# EAGLE design Arduino Maple Uno (EAGLE 9.2.2)
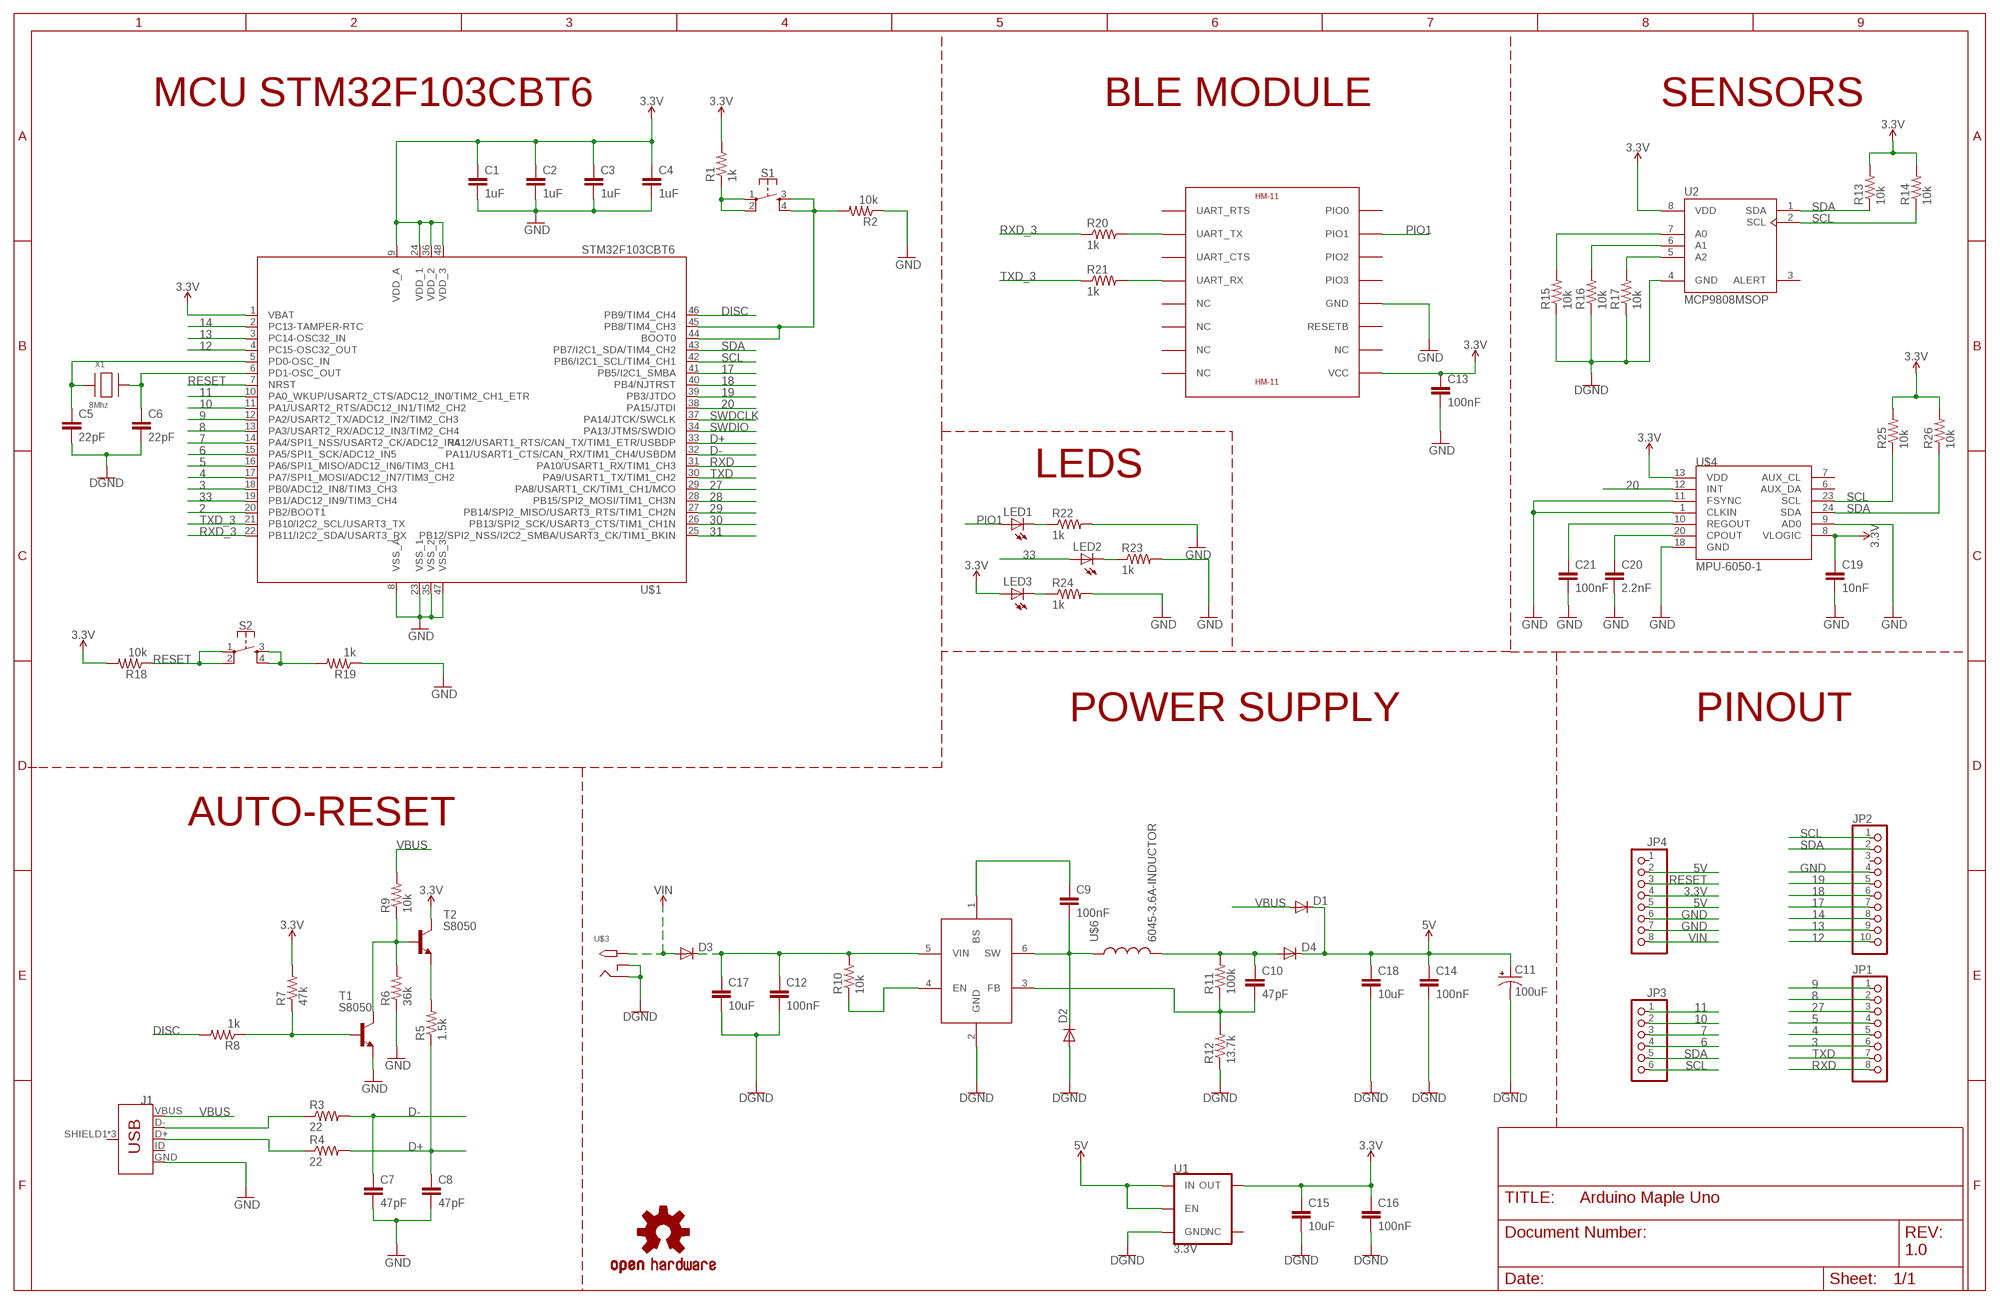
[diagram p0: schematic, sheet 1]

## Parts
C1  1uF  C-EUC0603  [C0603]
C2  1uF  C-EUC0603  [C0603]
C3  1uF  C-EUC0603  [C0603]
C4  1uF  C-EUC0603  [C0603]
C5  22pF  C-EUC0603  [C0603]
C6  22pF  C-EUC0603  [C0603]
C7  47pF  C-EUC0603  [C0603]
C8  47pF  C-EUC0603  [C0603]
C9  100nF  C-EUC0603  [C0603]
C10  47pF  C-EUC0603  [C0603]
C11  100uF  CPOL-USCT3528  [CT3528]
C12  100nF  C-EUC0603  [C0603]
C13  100nF  C-EUC0603  [C0603]
C14  100nF  C-EUC0603  [C0603]
C15  10uF  C-EUC0805  [C0805]
C16  100nF  C-EUC0603  [C0603]
C17  10uF  C-EUC1206  [C1206]
C18  10uF  C-EUC0805  [C0805]
C19  10nF  C-EUC0603  [C0603]
C20  2.2nF  C-EUC0603  [C0603]
C21  100nF  C-EUC0603  [C0603]
D1  DIODE-DO-214AC  [DO-214AC]
D2  DIODE-DO-214AC  [DO-214AC]
D3  DIODE-DO-214AC  [DO-214AC]
D4  DIODE-DO-214AC  [DO-214AC]
J1  USB_MICRO-B_FEMALE-SMT  [USB-B-MICRO-SMD]
JP1  PINHD-1X8  [1X08]
JP2  PINHD-1X10  [1X10]
JP3  PINHD-1X6  [1X06]
JP4  PINHD-1X8  [1X08]
LED1  LEDCHIPLED_0603  [CHIPLED_0603]
LED2  LEDCHIPLED_0603  [CHIPLED_0603]
LED3  LEDCHIPLED_0603  [CHIPLED_0603]
LOGO1  OSHW-LOGOL-COPPER  [OSHW-LOGO-L_COPPER]
R1  1k  R-US_R0603  [R0603]
R2  10k  R-US_R0603  [R0603]
R3  22  R-US_R0603  [R0603]
R4  22  R-US_R0603  [R0603]
R5  1.5k  R-US_R0603  [R0603]
R6  36k  R-US_R0603  [R0603]
R7  47k  R-US_R0603  [R0603]
R8  1k  R-US_R0603  [R0603]
R9  10k  R-US_R0603  [R0603]
R10  10k  R-US_R0603  [R0603]
R11  100k  R-US_R0603  [R0603]
R12  13.7k  R-US_R0603  [R0603]
R13  10k  R-US_R0603  [R0603]
R14  10k  R-US_R0603  [R0603]
R15  10k  R-US_R0603  [R0603]
R16  10k  R-US_R0603  [R0603]
R17  10k  R-US_R0603  [R0603]
R18  10k  R-US_R0603  [R0603]
R19  1k  R-US_R0603  [R0603]
R20  1k  R-US_R0603  [R0603]
R21  1k  R-US_R0603  [R0603]
R22  1k  R-US_R0603  [R0603]
R23  1k  R-US_R0603  [R0603]
R24  1k  R-US_R0603  [R0603]
R25  10k  R-US_R0603  [R0603]
R26  10k  R-US_R0603  [R0603]
S1  MOMENTARY-SWITCH-SPST-2-SMD-5.2MM  [TACTILE_SWITCH_SMD_5.2MM]
S2  MOMENTARY-SWITCH-SPST-2-SMD-5.2MM  [TACTILE_SWITCH_SMD_5.2MM]
T1  S8050  BC847  [SOT23]
T2  S8050  BC847  [SOT23]
U1  3.3V  V_REG_AP2112K-3.3V  [SOT23-5]
U2  MCP9808MSOP  [MSOP-8]
U$1  STM32F103CBT6  [STM32_LQFP48]
U$2  SY8113  [TSOT23-6]
U$3  2.1MMJACKTHM  [PJ-102A]
U$4  MPU-6050-1  [TESTING_QFN-24-4MM2]
U$5  HM-11  [HM-11]
U$6  6045-3.6A-INDUCTOR  [INDC6161X450]
X1  8Mhz  XTALNX5032  [NX5032]

## Nets
2: U$1.20(PB2/BOOT1)
3: JP1.6 U$1.18(PB0/ADC12_IN8/TIM3_CH3)
3.3V: C1.1 C2.1 C3.1 C4.1 C13.1 C15.1 C16.1 C19.1 JP4.4 LED3.A R1.2 R7.2 R13.2 R14.2 R18.2 R25.2 R26.2 T2.3(C) U1.5(OUT) U2.8(VDD) U$1.1(VBAT) U$1.9(VDD_A) U$1.24(VDD_1) U$1.36(VDD_2) U$1.48(VDD_3) U$4.8(VLOGIC) U$4.13(VDD) U$5.VCC
4: JP1.5 U$1.17(PA7/SPI1_MOSI/ADC12_IN7/TIM3_CH2)
5: JP1.4 U$1.16(PA6/SPI1_MISO/ADC12_IN6/TIM3_CH1)
5V: C11.+ C14.1 C18.1 D1.C D4.C JP4.2 JP4.5 U1.1(IN) U1.3(EN)
6: JP3.4 U$1.15(PA5/SPI1_SCK/ADC12_IN5)
7: JP3.3 U$1.14(PA4/SPI1_NSS/USART2_CK/ADC12_IN4)
8: JP1.2 U$1.13(PA3/USART2_RX/ADC12_IN3/TIM2_CH4)
9: JP1.1 U$1.12(PA2/USART2_TX/ADC12_IN2/TIM2_CH3)
10: JP3.2 U$1.11(PA1/USART2_RTS/ADC12_IN1/TIM2_CH2)
11: JP3.1 U$1.10(PA0_WKUP/USART2_CTS/ADC12_IN0/TIM2_CH1_ETR)
12: JP2.10 U$1.4(PC15-OSC32_OUT)
13: JP2.9 U$1.3(PC14-OSC32_IN)
14: JP2.8 U$1.2(PC13-TAMPER-RTC)
17: JP2.7 U$1.41(PB5/I2C1_SMBA)
18: JP2.6 U$1.40(PB4/NJTRST)
19: JP2.5 U$1.39(PB3/JTDO)
20: U$1.38(PA15/JTDI) U$4.12(INT)
27: JP1.3 U$1.29(PA8/USART1_CK/TIM1_CH1/MCO)
28: U$1.28(PB15/SPI2_MOSI/TIM1_CH3N)
29: U$1.27(PB14/SPI2_MISO/USART3_RTS/TIM1_CH2N)
30: U$1.26(PB13/SPI2_SCK/USART3_CTS/TIM1_CH1N)
31: U$1.25(PB12/SPI2_NSS/I2C2_SMBA/USART3_CK/TIM1_BKIN)
33: LED2.A U$1.19(PB1/ADC12_IN9/TIM3_CH4)
D+: C8.1 R4.2 R5.1 U$1.33(PA12/USART1_RTS/CAN_TX/TIM1_ETR/USBDP)
D-: C7.1 R3.2 U$1.32(PA11/USART1_CTS/CAN_RX/TIM1_CH4/USBDM)
DISC: R8.2 U$1.46(PB9/TIM4_CH4)
GND: C1.2 C2.2 C3.2 C4.2 C5.2 C6.2 C7.2 C8.2 C11.- C12.2 C13.2 C14.2 C15.2 C16.2 C17.2 C18.2 C19.2 C20.2 C21.2 D2.A J1.GND JP2.4 JP4.6 JP4.7 R2.1 R6.1 R12.1 R15.1 R16.1 R17.1 R19.1 R22.2 R23.2 R24.2 T1.2(E) U1.2(GND) U2.4(GND) U$1.8(VSS_A) U$1.23(VSS_1) U$1.35(VSS_2) U$1.47(VSS_3) U$2.2(GND) U$3.RING U$3.RING_SW U$4.1(CLKIN) U$4.9(AD0) U$4.11(FSYNC) U$4.18(GND) U$5.GND ; supply symbol labelled DGND
N$1: R1.1 S1.1 S1.2
N$2: C5.1 U$1.5(PD0-OSC_IN) X1.P$1
N$3: C6.1 U$1.6(PD1-OSC_OUT) X1.P$2
N$4: R2.2 S1.3 S1.4 U$1.44(BOOT0) U$1.45(PB8/TIM4_CH3)
N$5: C9.2 D2.C U$2.6(SW) U$6.1
N$6: J1.D- R3.1
N$7: J1.D+ R4.1
N$8: R5.2 T2.2(E)
N$9: R6.2 R9.1 T1.3(C) T2.1(B)
N$10: R7.1 R8.1 T1.1(B)
N$11: R19.2 S2.3 S2.4
N$12: LED1.C R22.1
N$13: R15.2 U2.7(A0)
N$14: R10.1 U$2.4(EN)
N$15: C9.1 U$2.1(BS)
N$16: C10.2 R11.1 R12.2 U$2.3(FB)
N$17: R16.2 U2.6(A1)
N$18: R17.2 U2.5(A2)
N$19: R20.2 U$5.UART_TX
N$20: C12.1 C17.1 D3.C R10.2 U$2.5(VIN)
N$21: R21.2 U$5.UART_RX
N$22: LED2.C R23.1
N$23: LED3.C R24.1
N$24: C10.1 D4.A R11.2 U$6.2
N$33: C21.1 U$4.10(REGOUT)
N$35: C20.1 U$4.20(CPOUT)
PIO1: LED1.A U$5.PIO1
RESET: JP4.3 R18.1 S2.1 S2.2 U$1.7(NRST)
RXD: JP1.8 U$1.31(PA10/USART1_RX/TIM1_CH3)
RXD_3: R20.1 U$1.22(PB11/I2C2_SDA/USART3_RX)
SCL: JP2.1 JP3.6 R14.1 R25.1 U2.2(SCL) U$1.42(PB6/I2C1_SCL/TIM4_CH1) U$4.23(SCL)
SDA: JP2.2 JP3.5 R13.1 R26.1 U2.1(SDA) U$1.43(PB7/I2C1_SDA/TIM4_CH2) U$4.24(SDA)
SWDCLK: U$1.37(PA14/JTCK/SWCLK)
SWDIO: U$1.34(PA13/JTMS/SWDIO)
TXD: JP1.7 U$1.30(PA9/USART1_TX/TIM1_CH2)
TXD_3: R21.1 U$1.21(PB10/I2C2_SCL/USART3_TX)
VBUS: D1.A J1.VBUS R9.2
VIN: D3.A JP4.8 U$3.TIP
Unconnected: J1.ID J1.SHIELD1(SHIELD) J1.SHIELD2(SHIELD) J1.SHIELD3(SHIELD) JP2.3 JP4.1 U1.4(NC) U2.3(ALERT) U$4.6(AUX_DA) U$4.7(AUX_CL) U$5.NC@5(NC) U$5.NC@6(NC) U$5.NC@7(NC) U$5.NC@8(NC) U$5.NC@10(NC) U$5.PIO0 U$5.PIO2 U$5.PIO3 U$5.RESETB U$5.UART_CTS U$5.UART_RTS

## Notes on the sheet
- MCU STM32F103CBT6 | BLE MODULE | SENSORS
- LEDS
- POWER SUPPLY | PINOUT
- AUTO-RESET
- 1.0

## Library data of the parts
C1-C6 C15 C18 = rcl:C-EU: CAPACITOR, European symbol; SPICEPREFIX: C
C7-C10 C12-C14 C16 C17 C19-C21 = resistor:C-EU: CAPACITOR, European symbol
C11 = rcl:CPOL-US: POLARIZED CAPACITOR, American symbol; SPICEPREFIX: C
D1-D4 = diode:DIODE-: DIODE
J1 = SparkFun-Connectors:USB_MICRO-B: USB Type Micro-B Connector Male/female and PTH/SMT variants SparkFun Products: SparkFun microB USB Breakout <https://www.sparkfun.com/products/12035> SparkFun USB microB Plug Breakout <https://www.sparkfun.com/products/10031> SparkFun ESP8266 Thing <https://www.sparkfun.com/products/13231>; PROD_ID: CONN-11752
JP1 JP4 = pinhead:PINHD-1X8: PIN HEADER
JP2 = pinhead:PINHD-1X10: PIN HEADER
JP3 = pinhead:PINHD-1X6: PIN HEADER
LED1-LED3 = led:LED: LED OSRAM: - CHIPLED LG R971, LG N971, LY N971, LG Q971, LY Q971, LO R971, LY R971 LH N974, LH R974 LS Q976, LO Q976, LY Q976 LO Q996 - Hyper CHIPLED LW Q18S LB Q993, LB Q99A, LB R99A - SideLED LS A670, LO A670, LY A670, LG A670, LP A670 LB A673, LV A673, LT A673, LW A673 LH A674 LY A675 LS A676, LA A676, LO A676, LY A676, LW A676 LS A679, LY A679, LG A679 - Hyper Micro SIDELED® LS Y876, LA Y876, LO Y876, LY Y876 LT Y87S - SmartLED LW L88C, LW L88S LB L89C, LB L89S, LG L890 LS L89K, LO L89K, LY L89K LS L896, LA L896, LO L896, LY L896 - TOPLED LS T670, LO T670, LY T670, LG T670, LP T670 LSG T670, LSP T670, LSY T670, LOP T670, LYG T670 LG T671, LOG T671, LSG T671 LB T673, LV T673, LT T673, LW T673 LH T674 LS T676, LA T676, LO T676, LY T676, LB T676, LH T676, LSB T676, LW T676 LB T67C, LV T67C, LT T67C, LS T67K, LO T67K, LY T67K, LW E67C LS E67B, LA E67B, LO E67B, LY E67B, LB E67C, LV E67C, LT E67C LW T67C LS T679, LY T679, LG T679 LS T770, LO T770, LY T770, LG T770, LP T770 LB T773, LV T773, LT T773, LW T773 LH T774 LS E675, LA E675, LY E675, LS T675 LS T776, LA T776, LO T776, LY T776, LB T776 LHGB T686 LT T68C, LB T68C - Hyper Mini TOPLED® LB M676 - Mini TOPLED Santana® LG M470 LS M47K, LO M47K, LY M47K Source: http://www.osram.convergy.de LUXEON: - LUMILED® LXK2-PW12-R00, LXK2-PW12-S00, LXK2-PW14-U00, LXK2-PW14-V00 LXK2-PM12-R00, LXK2-PM12-S00, LXK2-PM14-U00 LXK2-PE12-Q00, LXK2-PE12-R00, LXK2-PE12-S00, LXK2-PE14-T00, LXK2-PE14-U00 LXK2-PB12-K00, LXK2-PB12-L00, LXK2-PB12-M00, LXK2-PB14-N00, LXK2-PB14-P00, LXK2-PB14-Q00 LXK2-PR12-L00, LXK2-PR12-M00, LXK2-PR14-Q00, LXK2-PR14-R00 LXK2-PD12-Q00, LXK2-PD12-R00, LXK2-PD12-S00 LXK2-PH12-R00, LXK2-PH12-S00 LXK2-PL12-P00, LXK2-PL12-Q00, LXK2-PL12-R00 Source: www.luxeon.com KINGBRIGHT: KA-3528ASYC Source: www.kingbright.com
LOGO1 = SparkFun-Aesthetics:OSHW-LOGO: Open-Source Hardware (OSHW) Logo This logo indicates the piece of hardware it is found on incorporates a OSHW license and/or adheres to the definition of open source hardware found here: http://freedomdefined.org/OSHW
R1 R2 R10-R12 R18-R24 = rcl:R-US_: RESISTOR, American symbol; SPICEPREFIX: R
R3-R9 R13-R17 R25 R26 = resistor:R-US_: RESISTOR, American symbol
S1 S2 = SPEAR:MOMENTARY-SWITCH-SPST-2: Momentary Switch (Pushbutton) - SPST - Two Circuits Normally-open (NO) SPST momentary switches (buttons, pushbuttons). Schematic symbol includes two switch circuits. Variants SMD-4.6MMX2.8MM - 4.60mm x 2.80mm Tactile Momentary Button Switch - Used on SparkFun SAMD21 Mini Breakout <https://www.sparkfun.com/products/13664> SMD-5.2MM - Mini Pushbutton Switch - SMD <https://www.sparkfun.com/products/8720> - Used on Arduino Pro Mini <https://www.sparkfun.com/products/11114>; PROD_ID: SWCH-08247; SF_SKU: COM-08720
T1 T2 = transistor:BC847: NPN TRANSISTOR
U1 = SparkFun-IC-Power:V_REG_AP2112: AP2112 - 600mA CMOS LDO Regulator w/ Enable The AP2112 is CMOS process low dropout linear regulator with enable function, the regulator delivers a guaranteed 600mA (min.) continuous load current. Features Output Voltage Accuracy: ±1.5% Output Current: 600mA (Min.) Foldback Short Current Protection: 50mA Enable Function to Turn ON/OFF VOUT Low Dropout Voltage (3.3V): 250mV (Typ.) @IOUT=600mA Excellent Load Regulation: 0.2%/A (Typ.) Excellent Line Regulation: 0.02%/V (Typ.) Low Quiescent Current: 55μA (Typ.) Low Standby Current: 0.01μA (Typ.) Low Output Noise: 50μVRMS PSRR: 100Hz -65dB, 1kHz -65dB OTSD Protection Stable with 1.0μF Flexible Cap: Ceramic, Tantalum and Aluminum Electrolytic Operation Temperature Range: -40°C to 85°C ESD: MM 400V, HBM 4000V; PROD_ID: VREG-12457
U2 = LCSC:MCP9808; AVAILABILITY: Unavailable; DESCRIPTION: MCP9808 Series SMD 3.6 V Memory Module Digital Temperature Sensor - MSOP-8; MF: Microchip; MP: MCP9808-E/MS; PACKAGE: MSOP-8 Microchip; PRICE: None
U$1 = SPEAR:STM32F103CBT6
U$2 = LCSC:SY8113
U$3 = adafruit:2.1MMJACK: 2.1mm x 5.5mm THM DC jack with internal switch. Digikey part #PJ-102A, 4UCON part #05537 2.1mm x 5.5mm SMT DC jack with internal switch. Digikey part #PJ-002A-SMT, 4UCON part #03267 By microbuilder.eu & adafruit.com
U$4 = LCSC:MPU-6050
U$5 = LCSC:HM-11: JNHuaMao HM-11 Bluetooth 4.0 Transceiver based on TI CC2540/CC2541
U$6 = LCSC:6045-3.6A-INDUCTOR
X1 = adafruit:XTAL: Low cost SMT crystals, no capacitors included http://www.ladyada.net/library/eagle

## Board
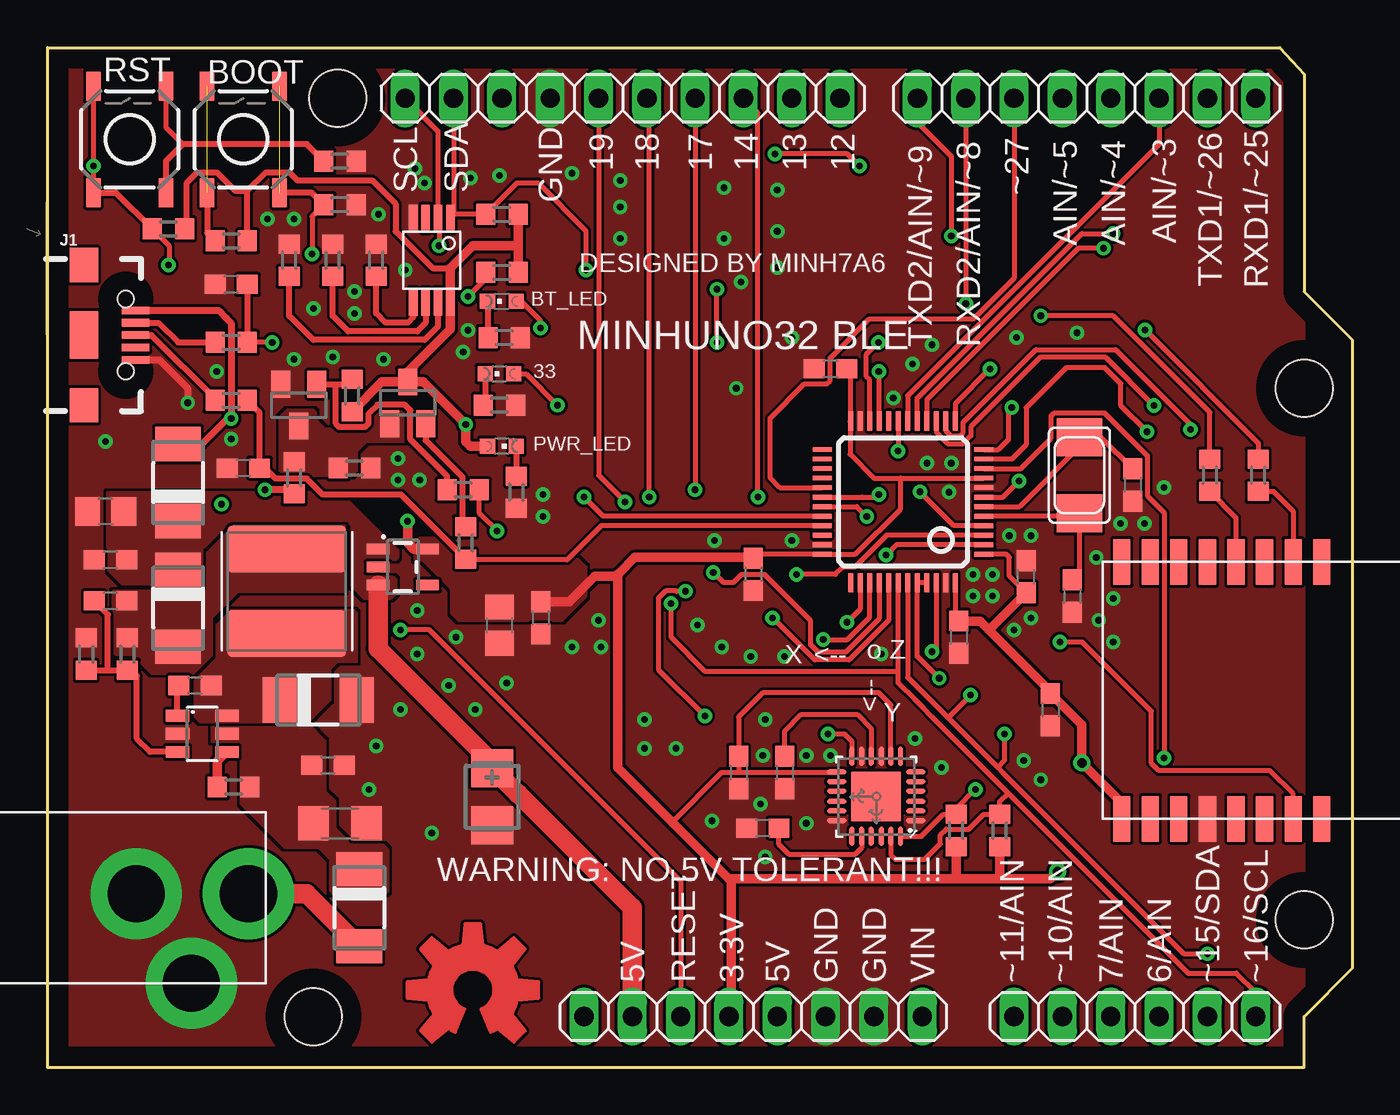
[diagram p1: board, top side]
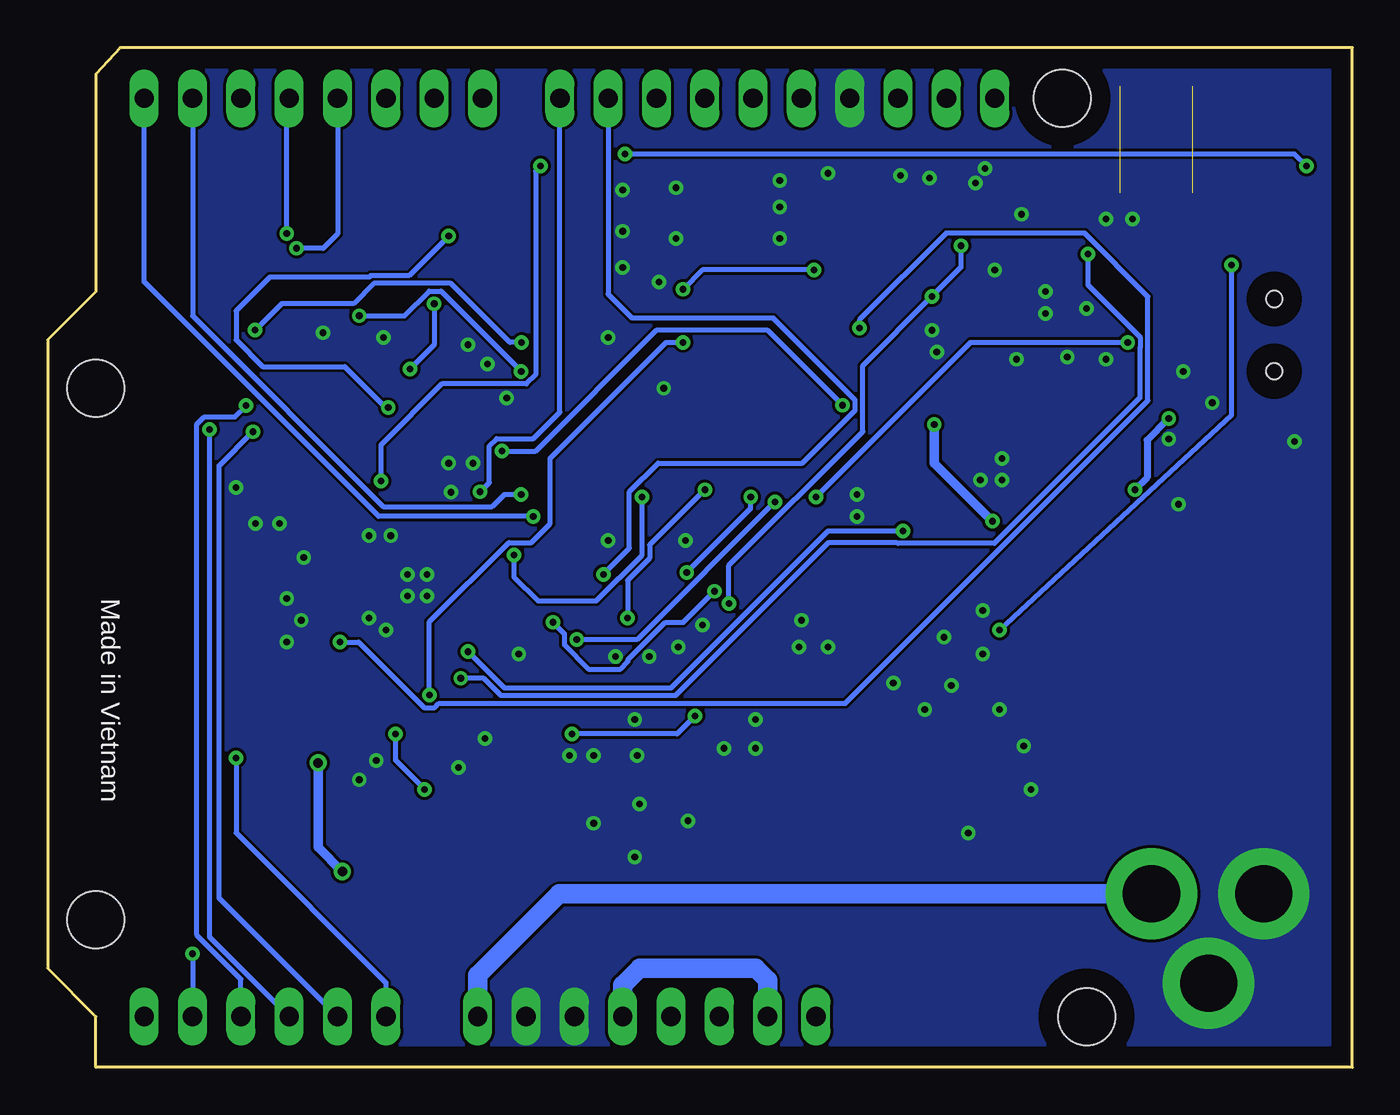
[diagram p2: board, bottom side, seen from below]

Size 68.58 x 53.59 mm. Coordinates in mm from the lower left corner, seen from the top.
Outline: 0,0 0,53.59 64.77,53.59 66.04,52.2 66.04,40.77 68.58,38.23 68.58,5.21 66.04,2.67 66.04,0 0,0
Copper layers (1*16): Top 0.035mm / dielectric 1.5mm / Bottom 0.035mm
Design rules "default *": minimum track width 6mil, minimum drill 0.35mm, track to track 6mil, track to pad 6mil, pad to pad 6mil, via to via 6mil, smd to smd 6mil, copper to edge 40mil, drill to drill 6mil, minimum pad ring 10mil, minimum via ring 8mil, stop-mask expansion 4mil, vias tented up to drill 15mil, thermal gap 10mil
Holes 3 mm at 15.24,50.93 66.04,35.69 66.04,7.75 13.97,2.67

### Footprints (pad centres in the part's own frame; a part is rotated, then mirrored left to right if it is on the bottom)
C0603 = smd 1.1 x 1: 1 -0.85,0; 2 0.85,0
CT3528 = smd 2 x 2.2: + -1.5,0; - 1.5,0
C0805 = smd 1.3 x 1.5: 1 -0.95,0; 2 0.95,0
C1206 = smd 1.6 x 1.8: 1 -1.4,0; 2 1.4,0
DO-214AC = smd 1.8 x 2.4: A 2.025,0; C -2.025,0
USB-B-MICRO-SMD = smd 1.45 x 0.4: D+ 2.725,0; D- 2.725,0.65; GND 2.725,-1.3; ID 2.725,-0.65; VBUS 2.725,1.3 | smd 1.5 x 1.8: SHIELD1 0,3.685; SHIELD2 0,-3.685 | smd 1.5 x 2.5: SHIELD3 0,0 | hole 0.85: 2.2,1.9; 2.2,-1.9
1X08 = drill 1.016 long: 1 -8.89,0; 2 -6.35,0; 3 -3.81,0; 4 -1.27,0; 5 1.27,0; 6 3.81,0; 7 6.35,0; 8 8.89,0
1X10 = drill 1.016 long: 1 -11.43,0; 2 -8.89,0; 3 -6.35,0; 4 -3.81,0; 5 -1.27,0; 6 1.27,0; 7 3.81,0; 8 6.35,0; 9 8.89,0; 10 11.43,0
1X06 = drill 1.016 long: 1 -6.35,0; 2 -3.81,0; 3 -1.27,0; 4 1.27,0; 5 3.81,0; 6 6.35,0
CHIPLED_0603 = smd 0.8 x 0.8: A 0,-0.75; C 0,0.75
R0603 = smd 1 x 1.1: 1 -0.85,0; 2 0.85,0
TACTILE_SWITCH_SMD_5.2MM = smd 1.524 x 0.762: 1 -2.794,1.905; 2 2.794,1.905; 3 -2.794,-1.905; 4 2.794,-1.905
SOT23 = smd 1 x 1.4: 1 -0.95,-1.1; 2 0.95,-1.1; 3 0,1.1
SOT23-5 = smd 0.55 x 1.2: 1 -0.95,-1.3; 2 0,-1.3; 3 0.95,-1.3; 4 0.95,1.3; 5 -0.95,1.3
MSOP-8 = smd 1.45 x 0.45: 1 -2.2,0.975; 2 -2.2,0.325; 3 -2.2,-0.325; 4 -2.2,-0.975; 5 2.2,-0.975; 6 2.2,-0.325; 7 2.2,0.325; 8 2.2,0.975
STM32_LQFP48 = smd 0.254 x 1: 1 -2.75,-4.25; 2 -2.25,-4.25; 3 -1.75,-4.25; 4 -1.25,-4.25; 5 -0.75,-4.25; 6 -0.25,-4.25; 7 0.25,-4.25; 8 0.75,-4.25; 9 1.25,-4.25; 10 1.75,-4.25; 11 2.25,-4.25; 12 2.75,-4.25; 25 2.75,4.25; 26 2.25,4.25; 27 1.75,4.25; 28 1.25,4.25; 29 0.75,4.25; 30 0.25,4.25; 31 -0.25,4.25; 32 -0.75,4.25; 33 -1.25,4.25; 34 -1.75,4.25; 35 -2.25,4.25; 36 -2.75,4.25 | smd 1 x 0.254: 13 4.25,-2.75; 14 4.25,-2.25; 15 4.25,-1.75; 16 4.25,-1.25; 17 4.25,-0.75; 18 4.25,-0.25; 19 4.25,0.25; 20 4.25,0.75; 21 4.25,1.25; 22 4.25,1.75; 23 4.25,2.25; 24 4.25,2.75; 37 -4.25,2.75; 38 -4.25,2.25; 39 -4.25,1.75; 40 -4.25,1.25; 41 -4.25,0.75; 42 -4.25,0.25; 43 -4.25,-0.25; 44 -4.25,-0.75; 45 -4.25,-1.25; 46 -4.25,-1.75; 47 -4.25,-2.25; 48 -4.25,-2.75
TSOT23-6 = smd 0.62 x 1.22: 1 -0.95,-1.3; 2 0,-1.3; 3 0.95,-1.3; 4 0.95,1.3; 5 0,1.3; 6 -0.95,1.3
PJ-102A = drill 3 pad 4.8: RING 0.1,-3.39; RING_SW -4.6,-6.29; TIP 0.1,-9.29
TESTING_QFN-24-4MM2 = smd 1.016 x 0.254: 1 -2.066,1.257; 2 -2.066,0.75; 3 -2.066,0.247; 4 -2.066,-0.287; 5 -2.066,-0.792; 6 -2.066,-1.297; 13 2.086,-1.297; 14 2.086,-0.792; 15 2.086,-0.287; 16 2.086,0.247; 17 2.086,0.75; 18 2.086,1.257 | smd 0.254 x 1.016: 7 -1.267,-2.122; 8 -0.762,-2.122; 9 -0.258,-2.122; 10 0.278,-2.122; 11 0.78,-2.122; 12 1.287,-2.122; 19 1.287,2.082; 20 0.78,2.082; 21 0.278,2.082; 22 -0.258,2.082; 23 -0.762,2.082; 24 -1.267,2.082 | smd 2.616 x 2.616: P$1 0.02,-0.01
HM-11 = smd 2.4 x 0.9: GND 6.5,0; NC@5 -7,0; NC@6 -7,-1.5; NC@7 -7,-3; NC@8 -7,-4.5; NC@10 6.5,-3; PIO0 6.5,6; PIO1 6.5,4.5; PIO2 6.5,3; PIO3 6.5,1.5; RESETB 6.5,-1.5; UART_CTS -7,3; UART_RTS -7,6; UART_RX -7,1.5; UART_TX -7,4.5; VCC 6.5,-4.5
INDC6161X450 = smd 2.479 x 6.229: 1 -2.225,0; 2 2.225,0
NX5032 = smd 2 x 2.4: P$1 2,0; P$2 -2,0

### Placement (x,y rotation side)
C1  41.15,36.7 180 top
C2  37.08,25.91 270 top
C3  47.88,22.61 270 top
C4  51.44,25.78 90 top
C5  53.85,24.77 270 top
C6  57.02,30.61 270 top
C7  9.65,41.15 180 top
C8  10.29,31.5 180 top
C9  7.75,20.07 0 top
C10  3.3,24.51 180 top
C11  23.37,14.22 270 top
C12  14.73,15.88 0 top
C13  52.7,18.8 270 top
C14  3.3,26.67 180 top
C15  23.75,23.24 270 top
C16  25.91,23.62 270 top
C17  15.37,12.83 0 top
C18  3.05,29.21 180 top
C19  36.32,15.49 270 top
C20  37.59,12.57 180 top
C21  38.73,15.49 270 top
D1  6.86,30.73 90 top
D2  14.22,19.3 0 top
D3  16.38,8.38 270 top
D4  6.86,24.13 270 top
J1  1.91,38.48 0 top
JP1  54.61,50.93 0 top
JP2  30.23,50.93 0 top
JP3  57.15,2.67 0 top
JP4  37.08,2.67 0 top
LED1  23.88,40.26 90 top
LED2  23.75,36.45 90 top
LED3  23.88,32.64 270 top
LOGO1  22.35,4.06 0 top
R1  9.65,43.43 0 top
R2  15.37,45.34 180 top
R3  9.65,38.1 0 top
R4  9.65,35.05 0 top
R5  21.97,27.56 90 top
R6  16.13,31.5 180 top
R7  16,35.31 270 top
R8  21.84,30.35 0 top
R9  12.95,30.99 270 top
R10  9.78,14.73 0 top
R11  4.19,21.72 90 top
R12  2.03,21.72 270 top
R13  23.88,44.83 0 top
R14  23.88,41.78 0 top
R15  12.7,42.42 270 top
R16  14.99,42.42 270 top
R17  17.27,42.42 270 top
R18  6.35,44.07 0 top
R19  15.37,47.62 180 top
R20  63.63,31.11 270 top
R21  61.09,31.11 270 top
R22  24,38.35 0 top
R23  23.75,34.8 0 top
R24  24.64,30.23 270 top
R25  50.04,12.45 270 top
R26  47.75,12.45 270 top
S1  10.29,48.77 90 top
S2  4.32,48.77 90 top
T1  13.21,34.8 180 top
T2  18.92,34.93 0 top
U1  18.67,26.29 270 top
U2  20.19,42.42 270 top
U$1  44.96,29.72 90 top
U$2  8.13,17.53 270 top
U$3  1.27,9.02 90 top
U$4  43.56,14.22 180 top
U$5  60.96,19.56 270 top
U$6  12.57,25.02 90 top
X1  54.23,31.11 270 top

### Tracks (layer width: path | path; a pad name or v marks a point on that pad's centre or on a via)
3
  Top 0.254: JP1.6 58.42,48.51 45.21,35.3 U$1.18
3.3V  (via drill 0.35, 0.5)
  Top 0.254: C1.1 42.21,36.49 U$1.24 42.17,33.94 42.17,32.21 43.42,30.97 44.83,30.97 | U$1.48 47.71,23.62 47.6,23.51 | 48.11,23.51 C3.1 | C4.1 50.55,25.82 50.55,26.8 50.38,26.97 U$1.1 | C2.1 37.29,26.97 U$1.36 42.46,26.97 44.83,29.34 44.83,30.97 | 44.83,30.97 U$1.9 | C13.1 52.61,19.74 52.61,19.85 | U$4.8 44.32,19.05 43.69,19.68 37.59,19.68 36.32,18.41 C19.1 36.32,15.49 | 32.83,12.89 35.43,15.49 36.32,15.49 | U$4.13 41.45,15.49 36.32,15.49
  Top 0.305: R1.2 10.5,46.06 | 10.5,46.06 11.48,47.04 12.7,47.04 13.13,46.61 17.06,46.61 18.29,45.38 18.29,43.94 20.23,42 21.17,42 | R18.2 7.32,44.18 7.32,46.48 7.88,47.04 8.89,47.04 9.87,46.06 10.5,46.06
  Top 0.381: 48.11,23.51 47.6,23.51
  Top 0.508: R7.2 17.57,36.03 T2.3 | R14.2 24.73,42.93 24.73,43.18 | 24.73,43.18 R13.2 | T2.3 19.74,36.03 v21.98,33.79 21.98,32.89 22.23,32.64 LED3.A | T2.3 18.92,36.55 21.17,38.79 U2.8 21.17,42 22.35,43.18 24.73,43.18 | C2.1 37.05,26.8 30.86,26.8 30.04,25.97 29.97,25.91 29.97,25.8 | 29.97,25.8 29.97,15.75 32.83,12.89 35.81,9.91 | 35.81,9.91 35.94,9.78 35.94,2.79 JP4.4 | 35.81,9.91 47.75,9.91 | 47.75,9.91 50.04,9.91 | 50.04,9.91 52.7,9.91 v53.09,10.29 | C3.1 49.01,23.46 49.44,23.02 | 49.44,23.02 52.61,19.85 | C4.1 49.53,23.02 49.44,23.02 | C13.1 54.36,17.99 v54.36,16 56.46,13.9 U$5.VCC | C16.1 27.43,24.47 28.76,25.8 29.97,25.8 | v18.92,28.7 18.92,27.56 19.24,27.24 U1.5 | R26.2 47.75,9.91 | R25.2 50.04,9.91
  Bottom 0.508: v21.98,33.79 21.98,31.76 v18.92,28.7 | v54.36,16 54.36,11.56 v53.09,10.29
  pour Top (no thermals): 19.3,26.67 19.68,26.67 21.21,25.15 21.21,23.88 21.59,23.49 27.05,23.49 27.94,24.38 28.32,24.77 28.32,26.29 26.8,27.81 20.07,27.81 19.56,27.81 19.3,27.56
4  (via drill 0.35)
  Top 0.254: U$1.17 45.71,35.17 54.36,43.82 v56.01,43.82
  Bottom 0.254: v56.01,43.82 56.01,50.8 JP1.5
5  (via drill 0.35)
  Top 0.254: v55.49,43.05 54.16,43.05 46.21,35.09 U$1.16
  Bottom 0.254: JP1.4 53.34,43.8 54.09,43.05 v55.49,43.05
5V
  Top 0.152: C11.+ 23.27,15.72 23.18,15.81
  Top 1.016: U1.3 17.37,22 23.18,16.19 23.18,15.81 | C11.+ 24.71,14.38 24.74,14.38 30.73,8.39 JP4.2
  Bottom 1.016: JP4.2 30.73,4.57 31.37,5.21 37.47,5.21 38.35,4.32 JP4.5
  pour Top (rank 3, no thermals): 3.94,25.4 3.17,26.16 3.17,30.23 15.37,30.23 18.41,27.18 18.41,26.8 18.29,26.67 16.76,26.67 16.64,26.54 16.64,25.78 18.16,25.78 18.29,25.65 18.29,24.89 18.03,24.64 16.64,24.64 16,25.27 16,28.45 15.75,28.7 11.68,28.7 8.38,25.4
6  (via drill 0.35)
  Top 0.254: v58.15,34.78 55.61,37.31 52.17,37.31 48.52,33.66 48.52,33.18 48.12,32.78 47.3,32.78 46.71,33.37 U$1.15
  Bottom 0.254: JP3.4 58.42,4.63 60.73,6.94 60.73,33.8 60.34,34.19 58.74,34.19 v58.15,34.78
7  (via drill 0.35)
  Top 0.254: v60.07,33.53 60.07,33.78 56.13,37.72 51.94,37.72 48.11,33.89 48.11,33.35 47.95,33.19 47.47,33.19 47.21,33.45 U$1.14
  Bottom 0.254: v60.07,33.53 60.07,6.86 JP3.3
8  (via drill 0.35)
  Top 0.254: JP1.2 v48.26,40.13 | v49.53,36.7 47.71,34.88 U$1.13
  Bottom 0.254: v48.26,40.13 48.26,37.97 v49.53,36.7
9  (via drill 0.35)
  Top 0.254: JP1.1 45.72,49.66 47.5,47.88 v47.5,43.69 | v50.67,34.67 50.48,34.48 50.48,32.98 49.97,32.47 U$1.12
  Bottom 0.254: v47.5,43.69 49.58,41.6 51.6,41.6 51.67,41.53 56.9,41.53 58.67,39.75 58.67,38.23 57.28,36.83 52.96,36.83 50.8,34.67 v50.67,34.67
10  (via drill 0.35)
  Top 0.254: v57.78,33.4 56.42,34.77 56.42,35.93 55.57,36.78 53.54,36.78 51.44,34.67 51.44,32.73 50.68,31.97 U$1.11
  Bottom 0.254: JP3.2 59.56,8.89 59.56,31.62 v57.78,33.4
11  (via drill 0.35)
  Top 0.254: U$1.10 51.15,31.47 52.75,33.07 52.75,34.23 52.91,34.39 55.55,34.39 57.8,32.14 57.8,30.04 58.69,29.15 58.69,16.27 v58.67,16.26
  Bottom 0.254: v58.67,16.26 58.67,12.32 50.8,4.44 JP3.1
12  (via drill 0.35)
  Top 0.254: U$1.4 47.63,28.47 v45.85,30.25
  Bottom 0.254: JP2.10 41.66,34.44 43.05,33.04 44.98,33.04 45.36,32.66 45.36,30.73 v45.85,30.25
13  (via drill 0.35)
  Top 0.254: U$1.3 44.1,27.97 42.42,26.29 41.78,26.29 41.4,25.91 v39.37,25.91
  Bottom 0.254: v39.37,25.91 38,27.28 38,30.24 36.49,31.75 28.91,31.75 26.14,34.53 26.14,35.07 30.44,39.37 37.85,39.37 39.12,40.64 JP2.9
14  (via drill 0.35)
  Top 0.254: U$1.2 44.61,27.47 v44.07,26.92 | v37.34,29.97 37.34,50.16 JP2.8
  Bottom 0.254: v44.07,26.92 44.07,25.78 42.8,24.51 39.75,24.51 37.34,26.92 v37.34,29.97
17  (via drill 0.35)
  Top 0.254: JP2.7 v34.04,30.35 | v38.1,23.62 38.12,23.62 40.33,21.41 42.12,21.41 44.21,23.5 U$1.41
  Bottom 0.254: v34.04,30.35 36.93,27.46 36.93,26.76 38.1,25.59 v38.1,23.62
18  (via drill 0.35)
  Top 0.254: v34.99,26.01 35.53,25.47 36.05,25.47 36.47,25.89 37.7,25.89 40.11,23.48 40.11,22.21 40.49,21.82 41.95,21.82 43.71,23.57 U$1.40 | v31.62,29.97 31.62,50.8 JP2.6
  Bottom 0.254: v34.99,26.01 31.62,29.38 v31.62,29.97
19  (via drill 0.35)
  Top 0.254: JP2.5 28.96,31.11 v30.35,29.72 | v40.77,22.48 42.04,22.48 43.21,23.65 U$1.39
  Bottom 0.254: v30.35,29.72 37.59,22.48 v40.77,22.48
20  (via drill 0.35)
  Top 0.254: U$1.38 42.71,24.08 v42.02,23.39 | v33.53,25.02 33.06,25.02 33.04,25.04 32.49,25.04 32.11,24.66 32.11,20.9 v34.54,18.47 | U$4.12 42.27,17.13 41.88,17.53 v41.02,17.53
  Bottom 0.254: v33.53,25.02 35.16,23.39 36.11,23.39 38.08,21.42 38.08,21.32 38.46,20.93 40.15,20.93 41.42,22.21 41.42,22.8 v42.02,23.39 | v41.02,17.53 35.49,17.53 v34.54,18.47
27
  Top 0.254: JP1.3 50.8,41.47 48.67,39.34 43.19,39.34 41.13,37.28 41.13,36.09 40.96,35.92 39.77,35.92 37.97,34.12 37.97,30.99 38.49,30.47 U$1.29
33  (via drill 0.35)
  Top 0.254: U$1.19 v44.71,32.39 v44.7,32.39 | LED2.A 25.15,36.45 v26.8,34.8
  Bottom 0.254: v44.7,32.39 42.93,32.39 36.55,38.76 30.76,38.76 v26.8,34.8
D+
  Top 0.254: U$1.33 29.1,28.47 27.3,26.67 22.01,26.67 R5.1
  Top 0.305: R4.2 11.14,34.42 C8.1 11.43,31.5 11.98,30.94 13.63,30.94 14.47,30.1 18.58,30.1 R5.1
D-  (via drill 0.35)
  Top 0.254: U$1.32 29.2,28.97 v28.19,29.97 | v11.81,38.1 R3.2
  Top 0.305: C7.1 R3.2
  Bottom 0.254: v28.19,29.97 20.07,38.1 v11.81,38.1
DISC  (via drill 0.35)
  Top 0.254: U$1.46 46.71,22.07 v46.48,21.84 | v23.62,28.19 22.8,29.02 22.69,29.13 R8.2
  Bottom 0.254: v46.48,21.84 44.58,19.94 35.81,19.94 27.56,28.19 v23.62,28.19
GND  (via drill 0.35)
  Top 0.381: J1.GND 5.87,37.18 7.37,35.69 v7.37,34.93
  other vias: 48.64,25.91 49.66,25.91 50.55,27.94 51.69,27.94 56.01,24.64 51.69,23.62 58.67,30.48 55.12,26.8 47.37,30.23 46.23,31.75 39.12,27.69 34.16,23.24 35.05,27.69 19.3,47.24 17.4,44.83 19.81,46.48 16.13,40.77 14.99,37.34 8.89,36.58 18.41,32 18.41,30.86 19.56,30.86 26.04,30.1 26.04,28.96 11.56,44.58 12.95,44.58 18.8,41.91 22.1,38.73 21.84,37.59 22.23,46.74 23.75,46.86 3.05,32.89 44.45,35.18 46.48,37.97 50.93,38.35 54.1,38.61 39.12,38.35 36.2,35.69 30.1,46.61 30.1,45.21 30.1,43.56 27.56,46.99 9.65,33.02 17.27,16.89 19.43,21.72 21.08,20.07 18.54,18.8 22.48,18.8 35.43,22.1 36.96,21.59 38.73,21.59 43.81,21.72 31.37,18.29 39.88,12.83 51.31,16.13 37.72,11.05 52.2,15.11 16.89,14.61 20.19,12.32 45.47,36.96 47.5,31.75 9.14,29.59 19.43,24 27.56,22.1 24.13,20.19 28.96,23.49 33.02,16.76 21.46,22.61 31.37,16.76 56.39,28.57 57.66,28.57 12.95,37.21 17.65,37.21 13.97,39.88 16.13,39.62 55.24,23.49 56.01,22.35 50.8,22.99 48.64,24.77 49.66,24.77 29.08,22.1 37.59,16.38 46.99,15.75 45.59,17.27 37.47,13.84 34.92,12.95 39.88,16.38 41.15,16.38 38.35,43.94 38.35,46.1 38.35,42.04 35.56,46.23 35.56,43.56 36.45,41.28 37.72,18.29
  pour Top (rank 6, no thermals): 0.13,53.47 0.13,0.13 66.04,0.13 66.04,52.2 64.77,53.47
  pour Bottom (no thermals): 0.13,53.47 0.13,0.13 66.04,0.13 66.04,52.32 64.9,53.47
N$1  (1 unrouted)
  Top 0.254: R1.1 9.06,43.43
  Top 0.305: S1.1 8.38,43.85 R1.1
N$2
  Top 0.254: U$1.5 54.08,28.97 X1.P$1 54.23,26 C5.1
N$3
  Top 0.254: U$1.6 51.09,29.47 54.23,32.61 X1.P$2 55.37,33.12 C6.1
N$4  (via drill 0.35)  (1 unrouted)
  Top 0.254: U$1.45 U$1.44 45.71,21.6 v46.86,20.45 | R2.2 13.9,44.73 v13.9,42.74
  Top 0.305: R2.2 13.88,45.97 S1.3
  Bottom 0.254: v13.9,42.74 13.9,41.12 11.15,38.37 11.15,37.83 11.18,37.8 11.18,35.18 18.82,27.54 23.89,27.54 23.92,27.56 27.56,27.56 35.59,19.53 44.74,19.53 45.66,20.45 v46.86,20.45
N$5
  pour Top (no thermals): 8.51,18.16 13.72,18.16 13.97,18.41 14.86,19.3 14.86,20.95 15.24,21.34 16.26,21.34 16.26,23.88 16.13,24 9.65,24 9.53,23.88 8.89,23.24 8.89,21.46 7.75,20.32 7.75,18.41 8,18.16
N$6
  Top 0.305: J1.D- 5.83,39.13 6.86,38.1 R3.1
N$7
  Top 0.305: J1.D+ 5.46,38.48 8.8,35.14 R4.1
N$8
  Top 0.305: R5.2 21.8,28.58 21.8,31.03 19.87,32.96 T2.2
N$9
  pour Top (no thermals): 12.45,31.11 16,31.11 16.26,31.37 16.26,31.5 16.26,32.39 16.64,32.77 16.76,32.89 18.8,32.89 19.05,33.15 19.05,34.54 18.67,34.93 17.4,34.93 17.14,34.67 17.14,33.91 16.76,33.53 14.61,33.53 14.1,34.04 14.1,34.42 13.97,34.54 12.57,34.54 12.19,34.16 12.19,31.37
N$10
  Top 0.305: T1.1 14.99,35.9 15.11,35.9 | 15.11,35.9 15.74,35.9 R7.1 | R8.1 20.99,31.07 19.07,33 19.07,34.53 18.76,34.83 17.35,34.83 16.86,34.34 16.86,33.83 16.68,33.65 15.33,33.65 15.15,33.83 15.15,35.86 15.11,35.9
N$11
  Top 0.254: S2.4 6.22,49.4 7.11,48.51
  Top 0.305: R19.2 13.63,48.51 7.11,48.51 6.22,47.62 S2.3
N$12
  Top 0.305: R22.1 23.15,40.23 LED1.C
N$13
  Top 0.305: U2.7 20.52,38.93 19.81,38.23 13.97,38.23 12.7,39.5 R15.2
N$14
  Top 0.508: U$2.4 8.93,16.08 R10.1
N$15
  Top 0.305: U$2.1 6.83,20 C9.1
N$16
  Top 0.152: R11.1 4.41,20.87
  Top 0.305: U$2.3 5.39,16.58 4.7,17.27 4.7,20.57 4.41,20.87 | R12.2 3.17,20.87 | 3.17,20.87 3.56,20.87 R11.1 | 3.17,20.87 3.17,23.79 C10.2
N$17
  Top 0.305: U2.6 19.87,39.12 19.43,38.68 15.8,38.68 14.99,39.5 R16.2
N$18
  Top 0.305: U2.5 19.22,39.41 18.95,39.14 17.75,39.14 17.27,39.62 R17.2
N$19
  Top 0.254: R20.2 64.42,30.27 65.46,29.22 U$5.UART_TX
N$20
  pour Top (rank 2, no thermals): 9.02,17.02 10.03,17.02 10.16,16.89 10.16,13.84 10.41,13.59 12.45,11.56 14.22,11.56 14.86,10.92 14.86,9.27 14.99,9.14 17.78,9.14 17.91,9.27 17.91,11.43 17.53,11.81 15.88,11.81 15.11,12.57 15.11,13.97 14.61,14.48 14.61,17.14 13.72,18.03 9.14,18.03 8.76,18.03 8.64,17.91 8.64,17.14 8.76,17.02
N$21
  Top 0.254: R21.2 62.46,28.89 U$5.UART_RX
N$22
  Top 0.305: LED2.C 23,34.9 R23.1
N$23
  Top 0.305: LED3.C R24.1
N$24
  pour Top (rank 2, no thermals): 3.43,25.02 3.43,21.84 3.56,21.72 4.45,21.72 5.46,20.7 7.87,20.7 8.64,21.46 8.64,23.62 10.03,25.02 15.62,25.02 15.62,28.45 9.78,28.45 8.38,27.05 8.38,25.02
N$33
  Top 0.254: C21.1 38.73,17.65 39.62,18.54 42.55,18.54 43.28,17.8 U$4.10
N$35
  Top 0.254: U$4.20 42.78,11.54 42.42,11.18 38.99,11.18 38.44,11.72 C20.1
PIO1  (via drill 0.35)
  Top 0.254: v53.21,22.35 54.39,22.35 58.02,18.72 58.02,15.98 58.4,15.6 64.23,15.6 65.46,14.37 U$5.PIO1 | v25.91,38.86 25.91,39.24 24.89,40.26 LED1.A
  Bottom 0.254: v53.21,22.35 52.24,22.35 48.79,18.9 48.24,18.9 48.02,19.13 26.65,19.13 10.75,35.03 10.75,40.51 14.07,43.84 21.35,43.84 25.91,39.28 v25.91,38.86
RESET  (via drill 0.35)
  Top 0.254: U$1.7 50.21,29.97 v51.05,30.81 | v42.67,47.37 42.04,48.01 v38.23,48.01 | v2.41,47.37 2.41,47.24 | 2.41,47.24 S2.1 | S2.2 2.41,47.24 | v6.35,42.16 6.39,42.2 6.39,43.18 R18.1 | JP4.3 33.27,9.78 20.07,22.99 v18.54,22.99
  Top 0.305: R18.1 3.6,45.97 S2.1
  Bottom 0.254: v51.05,30.81 51.05,32.72 47.85,35.92 43.42,35.92 42.93,36.41 42.93,47.12 v42.67,47.37 | v2.41,47.37 3.05,48.01 v38.23,48.01 | v18.54,22.99 6.35,34.29 v6.35,42.16
RXD  (via drill 0.35)
  Top 0.254: U$1.31 42.54,29.47 v43.05,28.96
  Bottom 0.254: v43.05,28.96 51.18,28.96 63.5,41.28 JP1.8
RXD_3  (via drill 0.35)
  Top 0.254: v57.68,38.76 63.63,32.81 R20.1 | U$1.22 43.21,36.13 43.03,36.3 43.03,37.47 v43.66,38.1
  Bottom 0.254: v43.66,38.1 44.28,38.1 47.38,41.2 51.43,41.2 52.49,40.13 56.26,40.13 57.64,38.76 v57.68,38.76
SCL  (via drill 0.35)
  Top 0.254: JP2.1 20.52,49.21 U2.2 20.57,44.56 v20.57,43.18 | v22.1,40.51 23.03,41.44 R14.1 | 44.71,20.83 44.71,20.19 45.59,19.3 46.04,18.86 46.48,18.41 46.93,17.97 50.48,14.41 | 44.71,20.83 U$1.42 | v32.77,24.38 32.77,22.61 34.54,20.83 44.71,20.83 | 50.48,14.41 59.94,4.95 62.48,4.95 63.5,3.94 JP3.6 | 50.48,14.41 50.04,13.97 R25.1 49.2,13.3 48.42,12.52 47.23,12.52 46.92,12.21 46.92,11.74 46.1,10.92 44.58,10.92 44.32,11.18 U$4.23
  Bottom 0.254: v20.57,43.18 20.57,42.04 v22.1,40.51 25.73,36.88 25.73,33.41 32.77,26.38 v32.77,24.38
SDA  (via drill 0.35)
  Top 0.254: JP2.2 21.34,44.79 U2.1 21.38,44.83 R13.1 24.68,46.48 25.78,46.48 28.3,43.97 v28.3,41.91 | U$1.43 45.21,20.49 47.33,18.37 | 47.33,18.37 49.93,15.77 | 49.93,15.77 50.18,15.51 59.01,6.68 59.73,5.97 v60.96,5.97 | 47.33,18.37 v48.51,19.56 | v35.18,38.1 v35.18,40.89 | v48.77,14.61 47.75,13.59 R26.1 47.08,13.3 45.92,12.14 U$4.24 | v50.29,17.53 50.29,16.13 49.93,15.77
  Bottom 0.254: v28.3,41.91 34.16,41.91 v35.18,40.89 | v48.51,19.56 48.51,23.41 44.34,27.58 43.16,27.58 42.16,28.57 42.16,32 36.07,38.1 v35.18,38.1 | v60.96,5.97 JP3.5 | v48.77,14.61 50.29,16.13 v50.29,17.53
TXD  (via drill 0.35)
  Top 0.254: U$1.30 42.8,29.97 43.56,29.97 v43.69,30.1
  Bottom 0.254: v43.69,30.1 44.58,30.1 45.21,29.46 50.93,29.46 60.96,39.5 JP1.7
TXD_3  (via drill 0.35)
  Top 0.254: R21.1 61.09,34.42 56.01,39.5 v52.2,39.5 | v43.69,36.58 43.69,33.99 U$1.21
  Bottom 0.254: v52.2,39.5 49.83,39.5 48.53,40.79 47.9,40.79 v43.69,36.58
VBUS  (via drill 0.35)
  Top 0.381: J1.VBUS 8.99,39.78 9.4,39.37 9.65,39.12 9.65,34.29 | 9.65,34.29 8.12,32.76 D1.A | R9.2 12.74,30.35 v11.43,30.35 | v9.65,34.1 9.65,34.29
  Bottom 0.381: v11.43,30.35 10.79,30.99 10.79,32.96 v9.65,34.1
VIN
  Top 1.016: U$3.TIP 13.62,9.12 D3.A
  Bottom 1.016: JP4.8 45.97,4.83 41.68,9.12 U$3.TIP

### Text on the board
tPlace: RST | BOOT | RXD1/~25 | 19 | 18 | 17 | 14 | 13 | 12 | SCL | SDA | ~27 | GND | AIN/~5 | AIN/~4 | AIN/~3 | DESIGNED BY MINH7A6 | TXD1/~26 | BT_LED | MINHUNO32 BLE | TXD2/AIN/~9 | RXD2/AIN/~8 | 33 | PWR_LED | X | <-- | o Z | <-- | Y | WARNING: NO 5V TOLERANT!!! | 5V | RESET | 3.3V | 5V | GND | GND | VIN | ~11/AIN | ~10/AIN | 7/AIN | 6/AIN | ~15/SDA | ~16/SCL
bPlace: Made in Vietnam